# Altium schematic sheet SENSORS.SchDoc
size A3; SheetNumber: 6; SheetTotal: 8
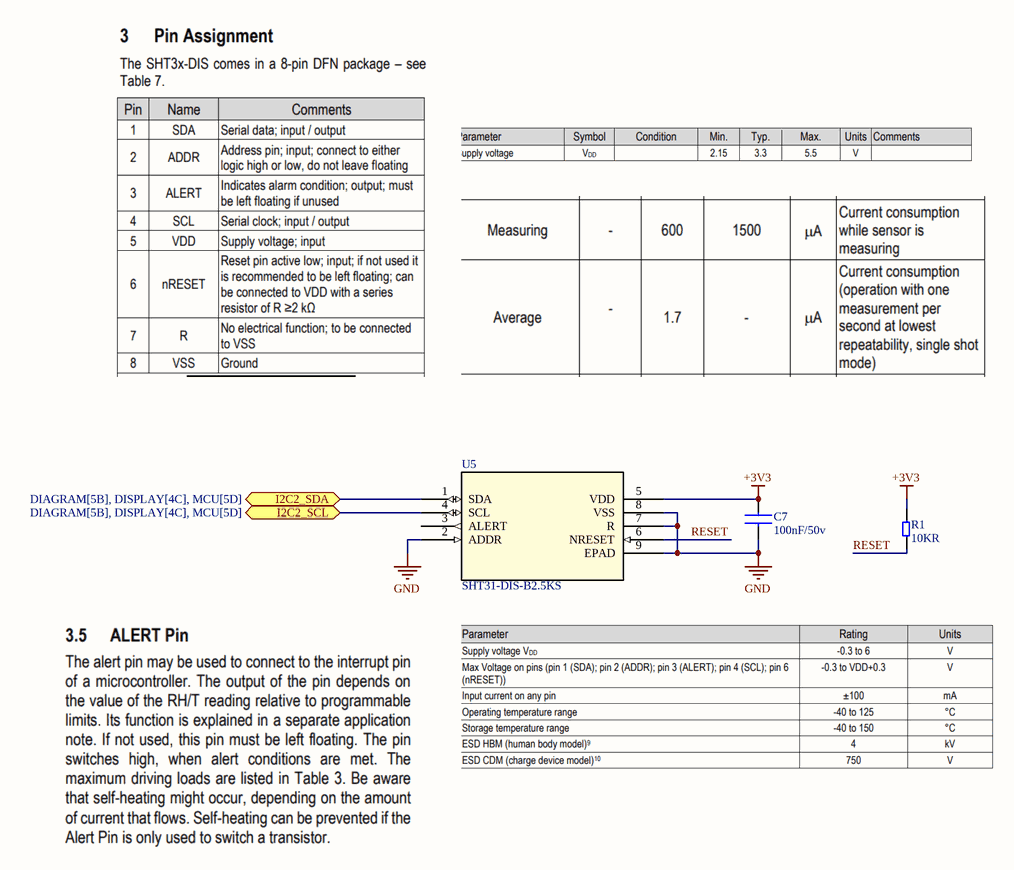
[diagram p0: SENSORS.SchDoc]

## Parts
C7  100nF/50v  [CAP-CER-0805]
R1  10KR  [RES-SMD-0805]
U5  SHT31-DIS-B2.5KS  [SHT31-DIS-B2.5KS_U_SHT3_SEN]

## Ports
I2C2_SCL (bidir, see DIAGRAM[5B], DISPLAY[4C], MCU[5D]), I2C2_SDA (bidir, see DIAGRAM[5B], DISPLAY[4C], MCU[5D])

## Nets
+3V3: C7.2 R1.2 U5.5(VDD)
GND: C7.1 U5.2(ADDR) U5.7(R) U5.8(VSS) U5.9(EPAD)
I2C2_SCL: U5.4(SCL) ; port I2C2_SCL
I2C2_SDA: U5.1(SDA) ; port I2C2_SDA
RESET: R1.1 U5.6(NRESET)

Not connected (* = marked no-connect by the designer): U5 3(ALERT)

## Library data of the parts
C7 = CAP-CER
R1 = ID-4: Điện Trở 10 KOhm 0805 1%; Design Item ID: ID-4; Value: 10KR
U5 = ID-3: Humidity, Temperature 0 ~ 100% RH I2C ±2% RH 8 s Surface Mount; Manufacturer_Name: Sensirion; Copyright: Copyright (C) 2025 Ultra Librarian. All rights reserved.; Manufacturer_Part_Number: SHT31-DIS-B2.5KS; RefDes: RefDes; Type: Type; Design Item ID: ID-3; Mfr# #: SHT31-DIS-B2.5KS